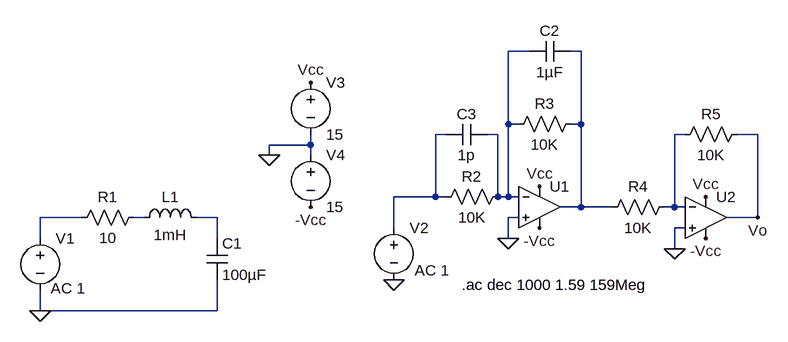
[diagram p0: schematic RLC_Bode.asc]
RLC_Bode.asc, the LTspice schematic file:
Version 4.1
SHEET 1 1104 680
WIRE 720 -160 688 -160
WIRE 800 -160 784 -160
WIRE 688 -48 688 -160
WIRE 704 -48 688 -48
WIRE 800 -48 800 -160
WIRE 800 -48 784 -48
WIRE 592 -32 576 -32
WIRE 672 -32 656 -32
WIRE 960 -32 944 -32
WIRE 1072 -32 1040 -32
WIRE 384 -16 384 -32
WIRE 384 -16 320 -16
WIRE 320 0 320 -16
WIRE 384 0 384 -16
WIRE 576 64 576 -32
WIRE 576 64 512 64
WIRE 592 64 576 64
WIRE 672 64 672 -32
WIRE 688 64 688 -48
WIRE 688 64 672 64
WIRE 704 64 688 64
WIRE 800 80 800 -48
WIRE 800 80 768 80
WIRE 848 80 800 80
WIRE 944 80 944 -32
WIRE 944 80 928 80
WIRE 960 80 944 80
WIRE 32 96 -32 96
WIRE 128 96 112 96
WIRE 240 96 208 96
WIRE 704 96 688 96
WIRE 1072 96 1072 -32
WIRE 1072 96 1024 96
WIRE 512 112 512 64
WIRE 960 112 944 112
WIRE -32 128 -32 96
WIRE 240 128 240 96
WIRE 688 128 688 96
WIRE 944 144 944 112
WIRE -32 240 -32 208
WIRE 240 240 240 192
WIRE 240 240 -32 240
FLAG -32 240 0
FLAG 512 192 0
FLAG 688 128 0
FLAG 944 144 0
FLAG 1072 96 Vo
FLAG 320 0 0
FLAG 384 80 -Vcc
FLAG 384 -112 Vcc
FLAG 736 48 Vcc
FLAG 992 64 Vcc
FLAG 736 112 -Vcc
FLAG 992 128 -Vcc
SYMBOL voltage -32 112 R0
WINDOW 123 16 93 Left 2
WINDOW 39 0 0 Left 0
SYMATTR Value2 AC 1
SYMATTR InstName V1
SYMATTR Value ""
SYMBOL ind 112 112 R270
WINDOW 0 32 56 VTop 2
WINDOW 3 5 56 VBottom 2
SYMATTR InstName L1
SYMATTR Value 1mH
SYMBOL res 128 80 R90
WINDOW 0 0 56 VBottom 2
WINDOW 3 32 56 VTop 2
SYMATTR InstName R1
SYMATTR Value 10
SYMBOL cap 224 128 R0
SYMATTR InstName C1
SYMATTR Value 100µF
SYMBOL voltage 512 96 R0
WINDOW 123 32 81 Left 2
WINDOW 39 0 0 Left 0
SYMATTR Value2 AC 1
SYMATTR InstName V2
SYMATTR Value ""
SYMBOL res 688 48 R90
WINDOW 0 0 56 VBottom 2
WINDOW 3 32 56 VTop 2
SYMATTR InstName R2
SYMATTR Value 10K
SYMBOL res 800 -64 R90
WINDOW 0 0 56 VBottom 2
WINDOW 3 32 56 VTop 2
SYMATTR InstName R3
SYMATTR Value 10K
SYMBOL cap 784 -176 R90
WINDOW 0 0 32 VBottom 2
WINDOW 3 32 32 VTop 2
SYMATTR InstName C2
SYMATTR Value 1µF
SYMBOL res 944 64 R90
WINDOW 0 0 56 VBottom 2
WINDOW 3 32 56 VTop 2
SYMATTR InstName R4
SYMATTR Value 10K
SYMBOL res 1056 -48 R90
WINDOW 0 0 56 VBottom 2
WINDOW 3 32 56 VTop 2
SYMATTR InstName R5
SYMATTR Value 10K
SYMBOL voltage 384 -128 R0
SYMATTR InstName V3
SYMATTR Value 15
SYMBOL voltage 384 -16 R0
SYMATTR InstName V4
SYMATTR Value 15
SYMBOL OpAmps\\UniversalOpAmp 736 80 R0
SYMATTR InstName U1
SYMATTR Value2 Avol=1Meg GBW=1000000Meg Vos=0
SYMBOL OpAmps\\UniversalOpAmp 992 96 R0
SYMATTR InstName U2
SYMATTR Value2 Avol=1Meg GBW=1000000Meg Vos=0
SYMBOL cap 656 -48 R90
WINDOW 0 0 32 VBottom 2
WINDOW 3 32 32 VTop 2
SYMATTR InstName C3
SYMATTR Value 1p
TEXT 616 200 Left 2 !.ac dec 1000 1.59 159Meg

The netlist it stands for:
* RLC_Bode.asc
V1 N005 0 AC 1
L1 N006 N007 1mH
R1 N006 N005 10
C1 N007 0 100µF
V2 N003 0 AC 1
R2 N001 N003 10K
R3 N002 N001 10K
C2 N002 N001 1µF
R4 N004 N002 10K
R5 Vo N004 10K
V3 Vcc 0 15
V4 0 -Vcc 15
X§U1 0 N001 Vcc -Vcc N002 level1 Avol=1Meg GBW=1000000Meg Vos=0 En=0 Enk=0 In=0 Ink=0 Rin=500Meg  ; pins In+ In- V+ V- OUT
X§U2 0 N004 Vcc -Vcc Vo level1 Avol=1Meg GBW=1000000Meg Vos=0 En=0 Enk=0 In=0 Ink=0 Rin=500Meg  ; pins In+ In- V+ V- OUT
C3 N001 N003 1p
.ac dec 1000 1.59 159Meg
.lib UniversalOpAmp1.lib
.backanno
.end